# Altium schematic sheet HUB_Sheet3.SchDoc
size A3
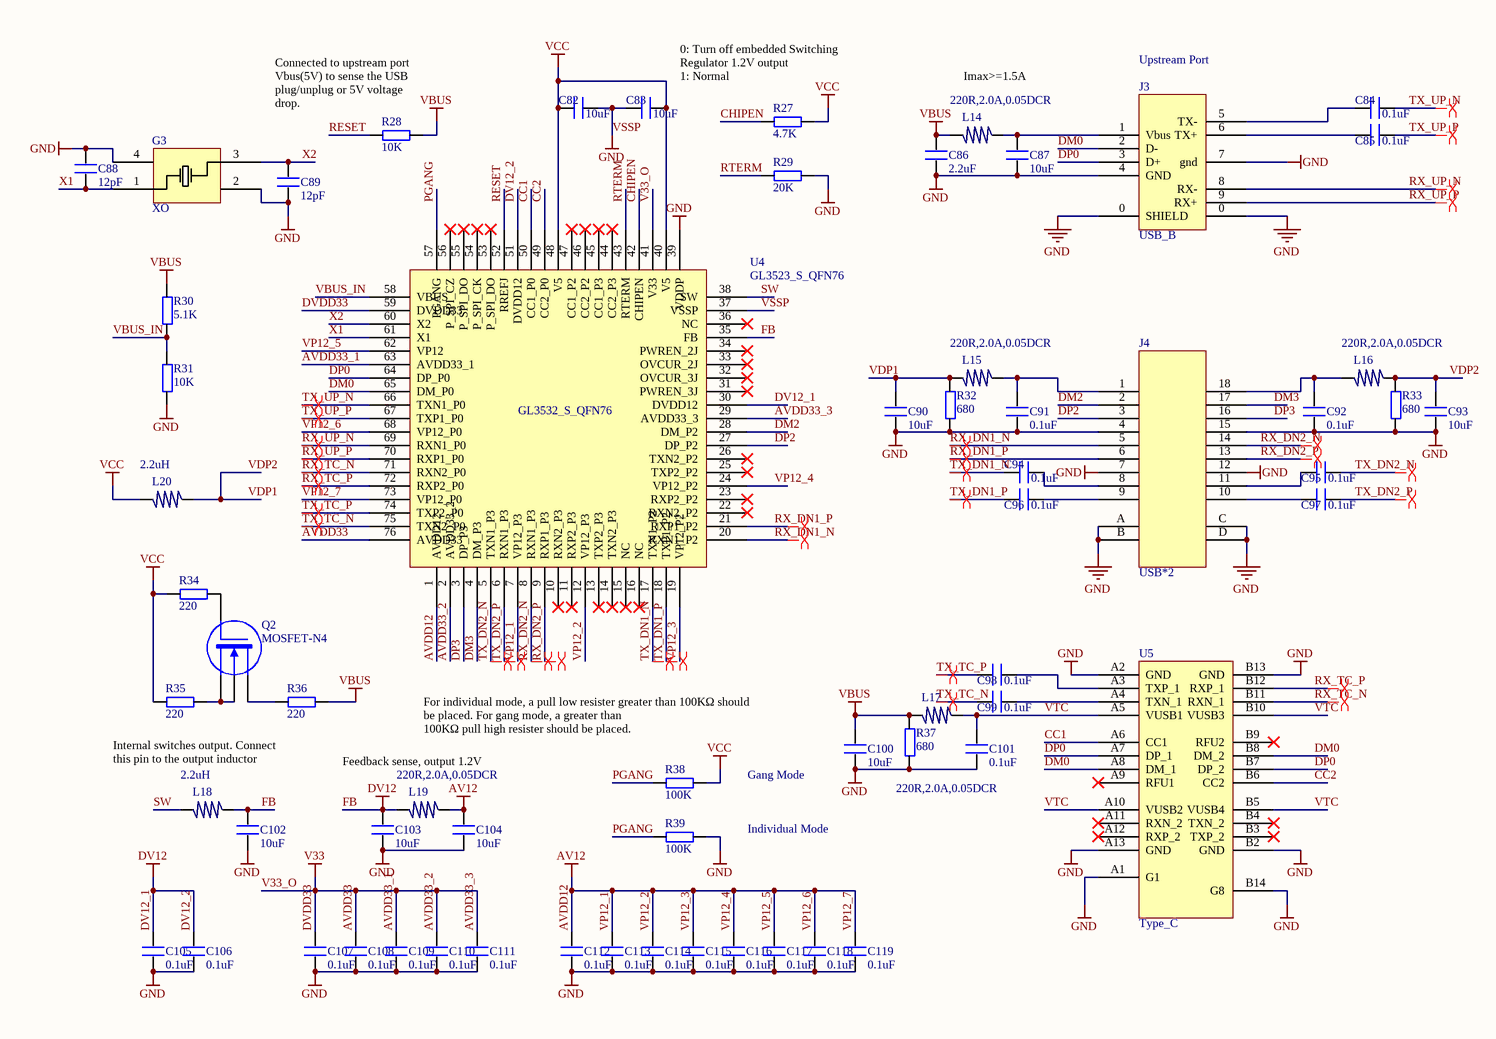
[diagram p0: HUB_Sheet3.SchDoc]

## Parts
C82  10uF  [0603P]
C83  10uF  [0603P]
C84  0.1uF  [0603P]
C85  0.1uF  [0603P]
C86  2.2uF  [0603P]
C87  10uF  [0603P]
C88  12pF  [0603P]
C89  12pF  [0603P]
C90  10uF  [0603P]
C91  0.1uF  [0603P]
C92  0.1uF  [0603P]
C93  10uF  [0603P]
C94  0.1uF  [0603P]
C95  0.1uF  [0603P]
C96  0.1uF  [0603P]
C97  0.1uF  [0603P]
C98  0.1uF  [0603P]
C99  0.1uF  [0603P]
C100  10uF  [0603P]
C101  0.1uF  [0603P]
C102  10uF  [0603P]
C103  10uF  [0603P]
C104  10uF  [0603P]
C105  0.1uF  [0603P]
C106  0.1uF  [0603P]
C107  0.1uF  [0603P]
C108  0.1uF  [0603P]
C109  0.1uF  [0603P]
C110  0.1uF  [0603P]
C111  0.1uF  [0603P]
C112  0.1uF  [0603P]
C113  0.1uF  [0603P]
C114  0.1uF  [0603P]
C115  0.1uF  [0603P]
C116  0.1uF  [0603P]
C117  0.1uF  [0603P]
C118  0.1uF  [0603P]
C119  0.1uF  [0603P]
G3  XO  [XTAL]
J3  USB_B  [USB3.0_TP]
J4  USB*2  [USB3.0_Double_DIP]
L14  220R,2.0A,0.05DCR  [0603P]
L15  220R,2.0A,0.05DCR  [0603P]
L16  220R,2.0A,0.05DCR  [0603P]
L17  220R,2.0A,0.05DCR  [0603P]
L18  2.2uH  [0603P]
L19  220R,2.0A,0.05DCR  [0603P]
L20  2.2uH  [0603P]
Q2  MOSFET-N4  [SOT-343_N]
R27  4.7K  [0603P]
R28  10K  [0603P]
R29  20K  [0603P]
R30  5.1K  [0603P]
R31  10K  [0603P]
R32  680  [0603P]
R33  680  [0603P]
R34  220  [0603P]
R35  220  [0603P]
R36  220  [0603P]
R37  680  [0603P]
R38  100K  [0603P]
R39  100K  [0603P]
U4  GL3523_S_QFN76  [GL3523_QFN76]
U5  Type_C

## Nets
AVDD12: C104.2 C112.2 C113.2 C114.2 C115.2 C116.2 C117.2 C118.2 C119.2 L19.1 U4.1(AVDD12) U4.7(VP12_P3) U4.12(VP12_P3) U4.19(VP12_P2) U4.24(VP12_P2) U4.62(VP12) U4.68(VP12_P0) U4.73(VP12_P0)  [also labelled AV12, VP12_1, VP12_2, VP12_3, VP12_4, VP12_5, VP12_6, VP12_7]
AVDD33: C107.2 C108.2 C109.2 C110.2 C111.2 U4.2(AVDD33_2) U4.29(AVDD33_3) U4.41(V33) U4.59(DVDD33) U4.63(AVDD33_1) U4.76(AVDD33)  [also labelled AVDD33_1, AVDD33_2, AVDD33_3, DVDD33, V33, V33_O]
DV12_1: C102.2 C103.2 C105.2 C106.2 L18.1 L19.2 U4.30(DVDD12) U4.35(FB) U4.51(DVDD12)  [also labelled DV12, DV12_2, FB]
VBUS: C86.2 C100.2 L14.2 L17.2 R28.2 R30.2 R36.2 R37.2
VCC: C82.1 C83.2 L20.2 R27.2 R34.1 R35.1 R38.2 U4.40(V5) U4.48(V5)
VSSP: C82.2 C83.1 C86.1 C87.1 C88.2 C89.1 C90.1 C91.1 C92.1 C93.1 C100.1 C101.1 C102.1 C103.1 C104.1 C105.1 C106.1 C107.1 C108.1 C109.1 C110.1 C111.1 C112.1 C113.1 C114.1 C115.1 C116.1 C117.1 C118.1 C119.1 G3.2 G3.4 J3.0(SHIELD) J3.4(GND) J3.7(gnd) J4.4 J4.7 J4.12 J4.15 J4.A J4.B J4.C J4.D R29.2 R31.1 R32.1 R33.1 R37.1 R39.2 U4.37(VSSP) U4.39(VDDP) U5.A1(G1) U5.A2(GND) U5.A13(GND) U5.B2(GND) U5.B13(GND) U5.B14(G8)  [also labelled GND]
CC1: U4.50(CC1_P0) U5.A6(CC1)
CC2: U4.49(CC2_P0) U5.B6(CC2)
CHIPEN: R27.1 U4.42(CHIPEN)
DM0: J3.2(D-) U4.65(DM_P0) U5.A8(DM_1) U5.B8(DM_2)
DM2: J4.2 U4.28(DM_P2)
DM3: J4.17 U4.4(DM_P3)
DP0: J3.3(D+) U4.64(DP_P0) U5.A7(DP_1) U5.B7(DP_2)
DP2: J4.3 U4.27(DP_P2)
DP3: J4.16 U4.3(DP_P3)
PGANG: R38.1 R39.1 U4.57(PGANG)
RESET: R28.1 U4.52(RREFJ)
RTERM: R29.1 U4.43(RTERM)
RX_DN1_N: J4.5 U4.20(RXN1_P2)
RX_DN1_P: J4.6 U4.21(RXP1_P2)
RX_DN2_N: J4.14 U4.8(RXN1_P3)
RX_DN2_P: J4.13 U4.9(RXP1_P3)
RX_TC_N: U4.71(RXN2_P0) U5.B11(RXN_1)
RX_TC_P: U4.72(RXP2_P0) U5.B12(RXP_1)
RX_UP_N: J3.8(RX-) U4.69(RXN1_P0)
RX_UP_P: J3.9(RX+) U4.70(RXP1_P0)
SW: L18.2 U4.38(SW)
TX_DN1_N: C94.1 U4.17(TXN1_P2)
TX_DN1_P: C96.1 U4.18(TXP1_P2)
TX_DN2_N: C95.2 U4.5(TXN1_P3)
TX_DN2_P: C97.2 U4.6(RXN1_P3)
TX_TC_N: C99.1 U4.75(TXN2_P0)
TX_TC_P: C98.1 U4.74(TXP2_P0)
TX_UP_N: C84.2 U4.66(TXN1_P0)
TX_UP_P: C85.2 U4.67(TXP1_P0)
VBUS_IN: R30.1 R31.2 U4.58(VBUS)
VDP1: C90.2 C93.2 L15.2 L16.1 L20.1 R32.2 R33.2  [also labelled VDP2]
VTC: C101.2 L17.1 U5.A5(VUSB1) U5.A10(VUSB2) U5.B5(VUSB4) U5.B10(VUSB3)
X1: C88.1 G3.1 U4.61(X1)
X2: C89.2 G3.3 U4.60(X2)
NetC84_1: C84.1 J3.5(TX-)
NetC85_1: C85.1 J3.6(TX+)
NetC87_2: C87.2 J3.1(Vbus) L14.1
NetC91_2: C91.2 J4.1 L15.1
NetC92_2: C92.2 J4.18 L16.2
NetC94_2: C94.2 J4.8
NetC95_1: C95.1 J4.11
NetC96_2: C96.2 J4.9
NetC97_1: C97.1 J4.10
NetC98_2: C98.2 U5.A3(TXP_1)
NetC99_2: C99.2 U5.A4(TXN_1)
NetQ2_1: Q2.1(G) R34.2
NetQ2_2: Q2.2(D) R36.1
NetQ2_3: Q2.3(U) Q2.4(S) R35.2

Not connected (* = marked no-connect by the designer): U4 10(RXN2_P3)* 11(RXP2_P3)* 13(TXP2_P3)* 14(TXN2_P3)* 15(NC)* 16(NC)* 22(RXN2_P2)* 23(RXP2_P2)* 25(TXP2_P2)* 26(TXN2_P2)* 31(PWREN_3J)* 32(OVCUR_3J)* 33(OVCUR_2J)* 34(PWREN_2J)* 36(NC)* 44(CC2_P3)* 45(CC1_P3)* 46(CC2_P2)* 47(CC1_P2)* 53(P_SPI_DO)* 54(P_SPI_CK)* 55(P_SPI_DO)* 56(P_SPI_CZ)*; U5 A9(RFU1)* A11(RXN_2)* A12(RXP_2)* B3(TXP_2)* B4(TXN_2)* B9(RFU2)*

## Layout directives
differential pair: RX_DN1_N, RX_DN1_P, RX_DN2_N, RX_DN2_P, RX_TC_N, RX_TC_P, RX_UP_N, RX_UP_P, TX_DN1_N, TX_DN1_P, TX_DN2_N, TX_DN2_P, TX_TC_N, TX_TC_P, TX_UP_N, TX_UP_P

## Notes on the sheet
- Upstream Port
- (near R28) Connected to upstream port Vbus(5V) to sense the USB plug/unplug or 5V voltage drop.
- 0: Turn off embedded Switching Regulator 1.2V output
  1: Normal
- Imax>=1.5A
- (near R38) For individual mode, a pull low resister greater than 100KΩ should be placed. For gang mode, a greater than
  100KΩ pull high resister should be placed.
- Internal switches output. Connect
  this pin to the output inductor
- Feedback sense, output 1.2V
- Gang Mode
- Individual Mode
- (in symbol GL3523_S_QFN76) GL3532_S_QFN76

## Library data of the parts
C82-C119 = C
G3 = XO: 25M XO
J3 = USB_B: USB3.0_B
L14-L20 = L
Q2 = MOSFET-N4: N-Channel MOSFET, Externally Terminated Substrate; Published: 24-Mar-1999; LatestRevisionDate: 29-May-2009; LatestRevisionNote: IPC-7351 Footprint Added.; PackageVersion: Sep-2000; PackageReference: SOT-343; Publisher: Altium Limited; PackageDescription: 4-Pin SOT-343 Package 1.3 mm Pitch, 2.1 mm Lead Span
R27-R39 = R